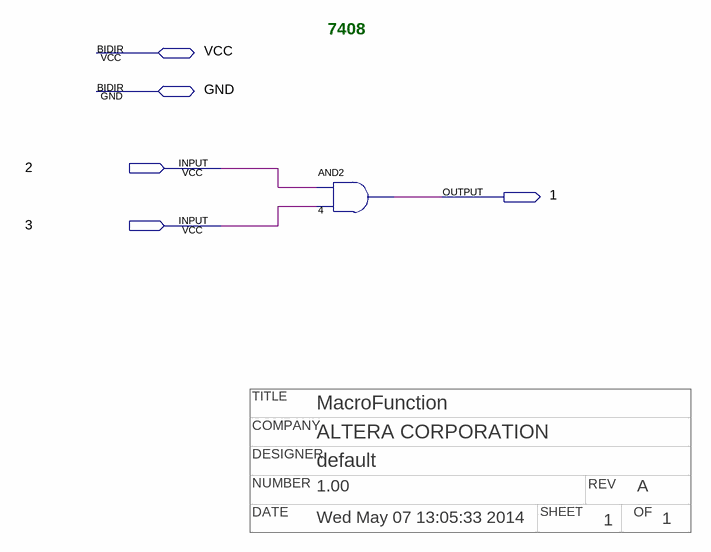
[diagram p0: schematic sheet]
// Quartus schematic np7408.bdf as structural Verilog: 1 symbols, 5 pins
// Title block: TITLE: MacroFunction; COMPANY: ALTERA CORPORATION; DESIGNER: default; NUMBER: 1.00; REV: A; DATE: Wed May 07 13:05:33 2014; SHEET: 1; OF: 1
module np7408 (
  input  \2 ,
  input  \3 ,
  inout  VCC,
  inout  GND,
  output \1 
);

  and u_4 (\1 , \2 , \3 );

  // Notes on the sheet:
  //   7408
endmodule
